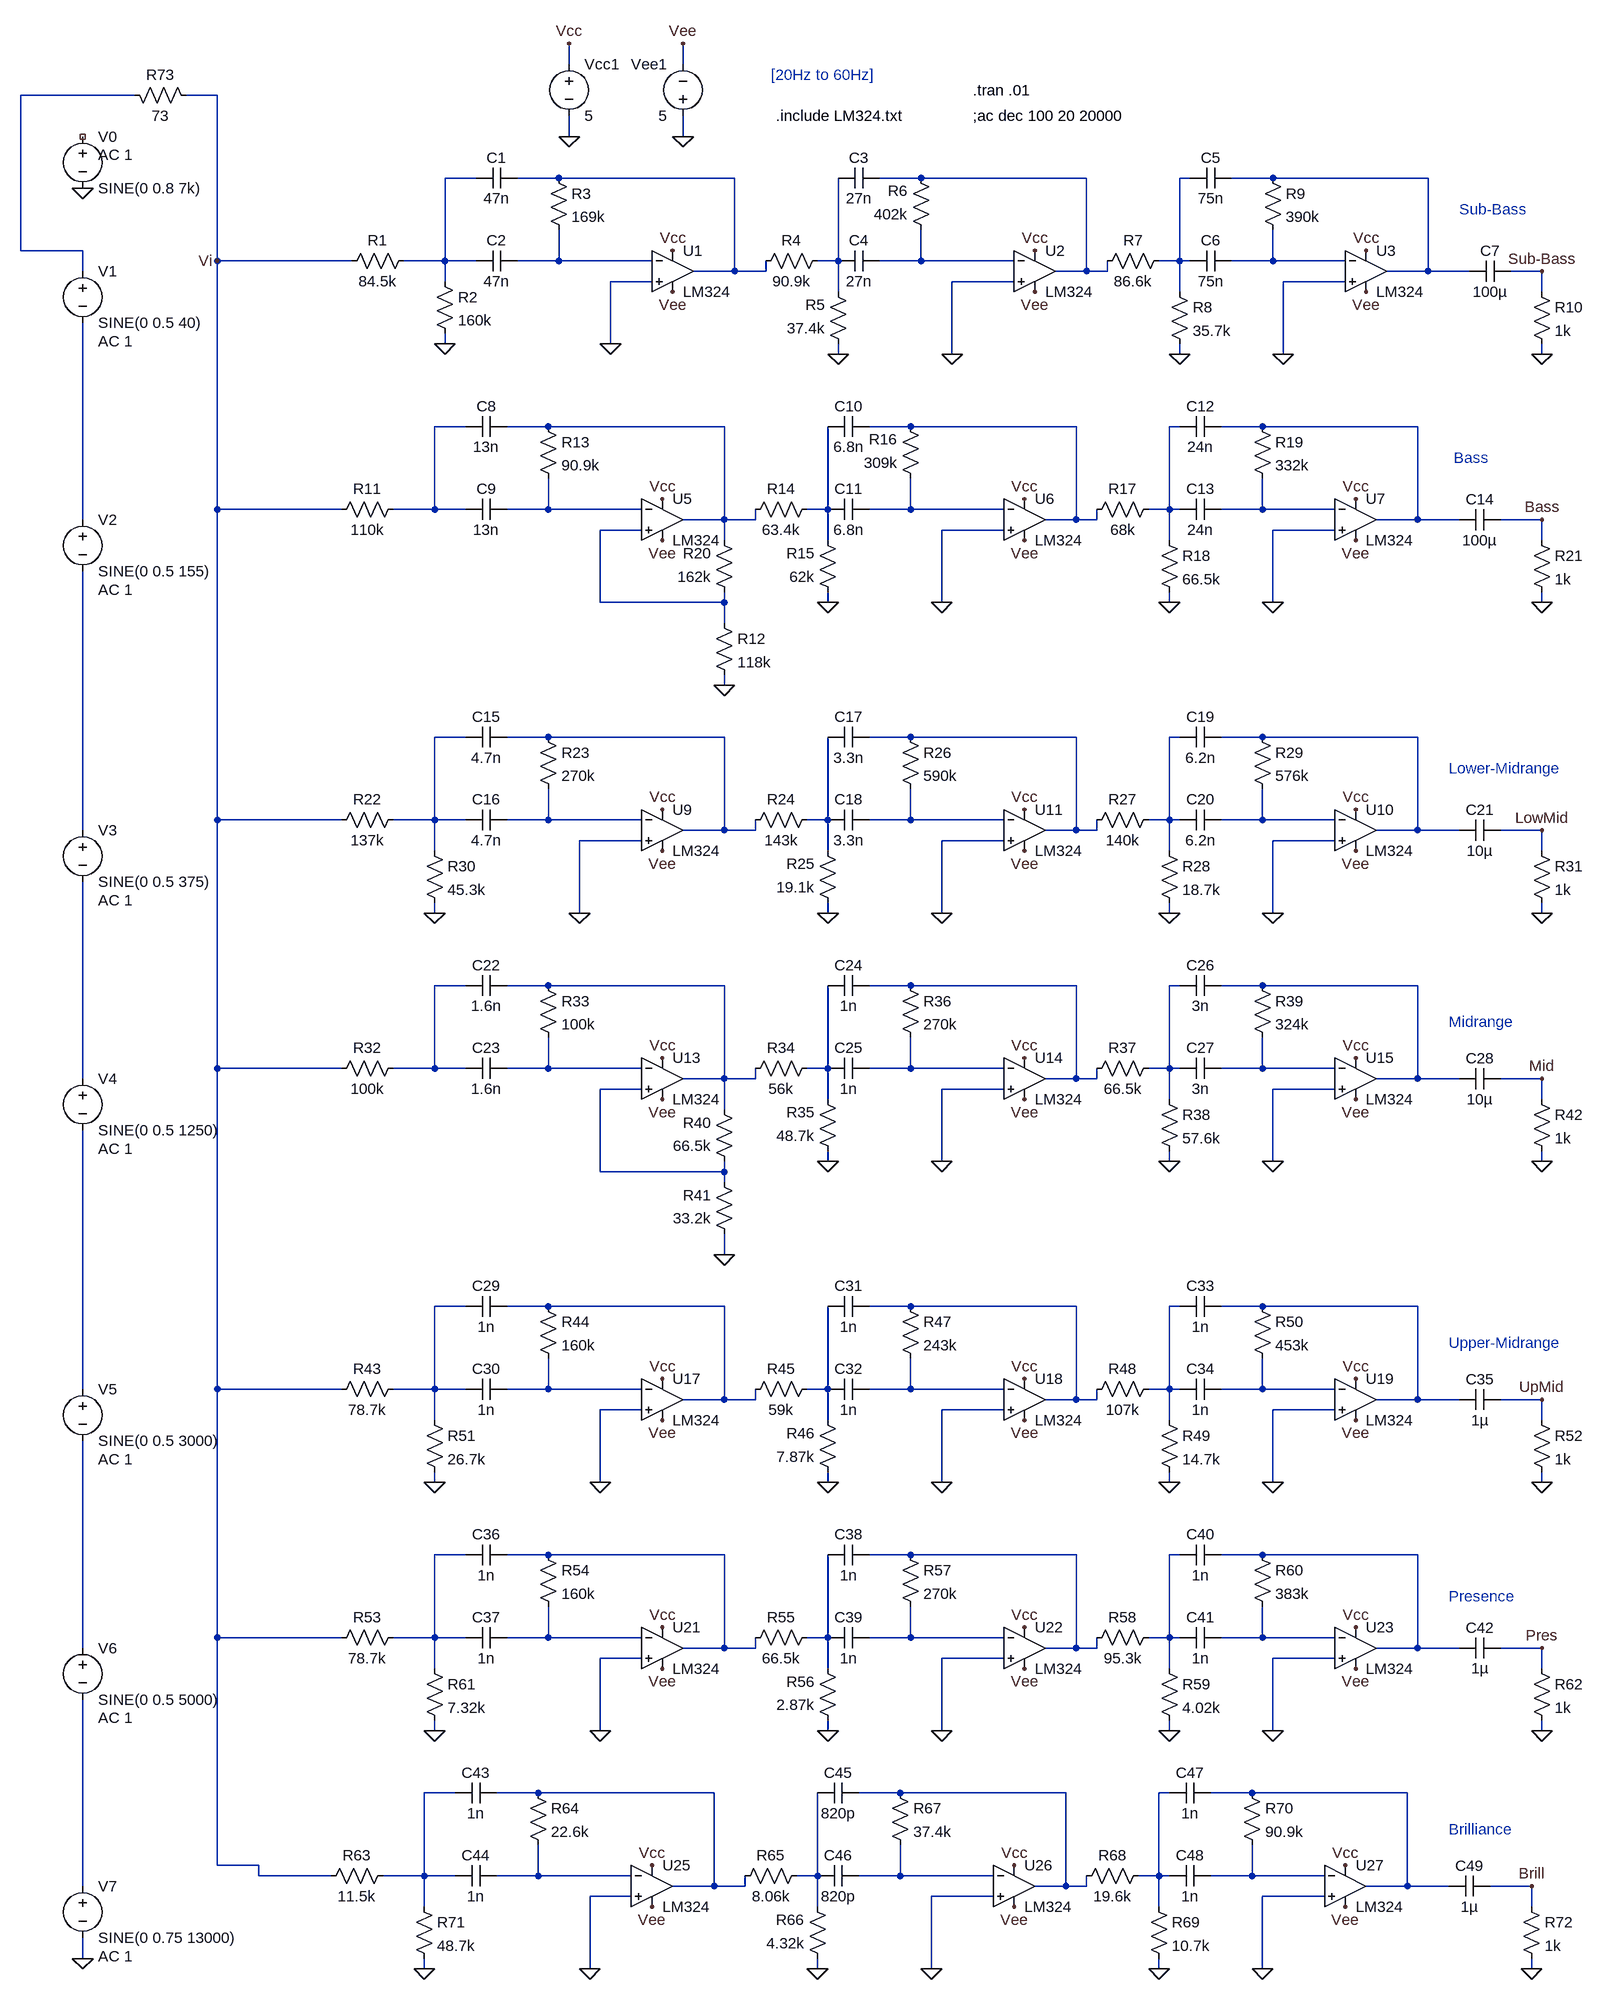
[diagram p0: schematic AllFilters.asc]
AllFilters.asc, the LTspice schematic file:
Version 4
SHEET 1 1368 1572
WIRE -208 -1392 -208 -1424
WIRE -32 -1392 -32 -1424
WIRE -880 -1344 -1056 -1344
WIRE -752 -1344 -800 -1344
WIRE -208 -1280 -208 -1312
WIRE -32 -1280 -32 -1312
WIRE -352 -1216 -400 -1216
WIRE -224 -1216 -288 -1216
WIRE 48 -1216 -224 -1216
WIRE 336 -1216 272 -1216
WIRE 592 -1216 336 -1216
WIRE 752 -1216 736 -1216
WIRE 880 -1216 816 -1216
WIRE 1120 -1216 880 -1216
WIRE -1056 -1104 -1056 -1344
WIRE -960 -1104 -1056 -1104
WIRE -752 -1088 -752 -1344
WIRE -544 -1088 -752 -1088
WIRE -400 -1088 -400 -1216
WIRE -400 -1088 -464 -1088
WIRE -352 -1088 -400 -1088
WIRE -224 -1088 -224 -1136
WIRE -224 -1088 -288 -1088
WIRE -80 -1088 -224 -1088
WIRE 208 -1088 208 -1216
WIRE 208 -1088 176 -1088
WIRE 336 -1088 336 -1136
WIRE 336 -1088 272 -1088
WIRE 480 -1088 336 -1088
WIRE 736 -1088 736 -1216
WIRE 736 -1088 704 -1088
WIRE 752 -1088 736 -1088
WIRE 880 -1088 880 -1136
WIRE 880 -1088 816 -1088
WIRE 992 -1088 880 -1088
WIRE -960 -1072 -960 -1104
WIRE 48 -1072 48 -1216
WIRE 48 -1072 -16 -1072
WIRE 96 -1072 96 -1088
WIRE 96 -1072 48 -1072
WIRE 592 -1072 592 -1216
WIRE 592 -1072 544 -1072
WIRE 624 -1072 624 -1088
WIRE 624 -1072 592 -1072
WIRE 1120 -1072 1120 -1216
WIRE 1120 -1072 1056 -1072
WIRE 1184 -1072 1120 -1072
WIRE 1296 -1072 1248 -1072
WIRE -400 -1056 -400 -1088
WIRE -80 -1056 -144 -1056
WIRE 480 -1056 384 -1056
WIRE 992 -1056 896 -1056
WIRE 208 -1040 208 -1088
WIRE 736 -1040 736 -1088
WIRE 1296 -1040 1296 -1072
WIRE -400 -960 -400 -976
WIRE -144 -960 -144 -1056
WIRE 208 -944 208 -960
WIRE 384 -944 384 -1056
WIRE 736 -944 736 -960
WIRE 896 -944 896 -1056
WIRE 1296 -944 1296 -960
WIRE -368 -832 -416 -832
WIRE -240 -832 -304 -832
WIRE 32 -832 -240 -832
WIRE 320 -832 256 -832
WIRE 576 -832 320 -832
WIRE 736 -832 720 -832
WIRE 864 -832 800 -832
WIRE 1104 -832 864 -832
WIRE -752 -704 -752 -1088
WIRE -560 -704 -752 -704
WIRE -416 -704 -416 -832
WIRE -416 -704 -480 -704
WIRE -368 -704 -416 -704
WIRE -240 -704 -240 -752
WIRE -240 -704 -304 -704
WIRE -96 -704 -240 -704
WIRE 192 -704 192 -832
WIRE 192 -704 160 -704
WIRE 320 -704 320 -752
WIRE 320 -704 256 -704
WIRE 464 -704 320 -704
WIRE 720 -704 720 -832
WIRE 720 -704 688 -704
WIRE 736 -704 720 -704
WIRE 864 -704 864 -752
WIRE 864 -704 800 -704
WIRE 976 -704 864 -704
WIRE -960 -688 -960 -992
WIRE 32 -688 32 -832
WIRE 32 -688 -32 -688
WIRE 80 -688 80 -704
WIRE 80 -688 32 -688
WIRE 576 -688 576 -832
WIRE 576 -688 528 -688
WIRE 608 -688 608 -704
WIRE 608 -688 576 -688
WIRE 1104 -688 1104 -832
WIRE 1104 -688 1040 -688
WIRE 1168 -688 1104 -688
WIRE 1296 -688 1232 -688
WIRE -96 -672 -160 -672
WIRE 464 -672 368 -672
WIRE 976 -672 880 -672
WIRE 32 -656 32 -688
WIRE 192 -656 192 -704
WIRE 720 -656 720 -704
WIRE 1296 -656 1296 -688
WIRE -160 -560 -160 -672
WIRE 32 -560 32 -576
WIRE 32 -560 -160 -560
WIRE 192 -560 192 -576
WIRE 368 -560 368 -672
WIRE 720 -560 720 -576
WIRE 880 -560 880 -672
WIRE 1296 -560 1296 -576
WIRE 32 -528 32 -560
WIRE 32 -432 32 -448
WIRE -368 -352 -416 -352
WIRE -240 -352 -304 -352
WIRE 32 -352 -240 -352
WIRE 320 -352 256 -352
WIRE 576 -352 320 -352
WIRE 736 -352 720 -352
WIRE 864 -352 800 -352
WIRE 1104 -352 864 -352
WIRE -752 -224 -752 -704
WIRE -560 -224 -752 -224
WIRE -416 -224 -416 -352
WIRE -416 -224 -480 -224
WIRE -368 -224 -416 -224
WIRE -240 -224 -240 -272
WIRE -240 -224 -304 -224
WIRE -96 -224 -240 -224
WIRE 192 -224 192 -352
WIRE 192 -224 160 -224
WIRE 320 -224 320 -272
WIRE 320 -224 256 -224
WIRE 464 -224 320 -224
WIRE 720 -224 720 -352
WIRE 720 -224 688 -224
WIRE 736 -224 720 -224
WIRE 864 -224 864 -272
WIRE 864 -224 800 -224
WIRE 976 -224 864 -224
WIRE -960 -208 -960 -608
WIRE 32 -208 32 -352
WIRE 32 -208 -32 -208
WIRE 80 -208 80 -224
WIRE 80 -208 32 -208
WIRE 576 -208 576 -352
WIRE 576 -208 528 -208
WIRE 608 -208 608 -224
WIRE 608 -208 576 -208
WIRE 1104 -208 1104 -352
WIRE 1104 -208 1040 -208
WIRE 1168 -208 1104 -208
WIRE 1296 -208 1232 -208
WIRE -96 -192 -192 -192
WIRE 464 -192 368 -192
WIRE 976 -192 880 -192
WIRE -416 -176 -416 -224
WIRE 192 -176 192 -224
WIRE 720 -176 720 -224
WIRE 1296 -176 1296 -208
WIRE -416 -80 -416 -96
WIRE -192 -80 -192 -192
WIRE 192 -80 192 -96
WIRE 368 -80 368 -192
WIRE 720 -80 720 -96
WIRE 880 -80 880 -192
WIRE 1296 -80 1296 -96
WIRE -368 32 -416 32
WIRE -240 32 -304 32
WIRE 32 32 -240 32
WIRE 320 32 256 32
WIRE 576 32 320 32
WIRE 736 32 720 32
WIRE 864 32 800 32
WIRE 1104 32 864 32
WIRE -752 160 -752 -224
WIRE -560 160 -752 160
WIRE -416 160 -416 32
WIRE -416 160 -480 160
WIRE -368 160 -416 160
WIRE -240 160 -240 112
WIRE -240 160 -304 160
WIRE -96 160 -240 160
WIRE 192 160 192 32
WIRE 192 160 160 160
WIRE 320 160 320 112
WIRE 320 160 256 160
WIRE 464 160 320 160
WIRE 720 160 720 32
WIRE 720 160 688 160
WIRE 736 160 720 160
WIRE 864 160 864 112
WIRE 864 160 800 160
WIRE 976 160 864 160
WIRE -960 176 -960 -128
WIRE 32 176 32 32
WIRE 32 176 -32 176
WIRE 80 176 80 160
WIRE 80 176 32 176
WIRE 576 176 576 32
WIRE 576 176 528 176
WIRE 608 176 608 160
WIRE 608 176 576 176
WIRE 1104 176 1104 32
WIRE 1104 176 1040 176
WIRE 1168 176 1104 176
WIRE 1296 176 1232 176
WIRE -96 192 -160 192
WIRE 464 192 368 192
WIRE 976 192 880 192
WIRE 192 208 192 160
WIRE 720 208 720 160
WIRE 1296 208 1296 176
WIRE 32 224 32 176
WIRE 192 304 192 288
WIRE 368 304 368 192
WIRE 720 304 720 288
WIRE 880 304 880 192
WIRE 1296 304 1296 288
WIRE -160 320 -160 192
WIRE 32 320 32 304
WIRE 32 320 -160 320
WIRE 32 336 32 320
WIRE 32 448 32 416
WIRE -368 528 -416 528
WIRE -240 528 -304 528
WIRE 32 528 -240 528
WIRE 320 528 256 528
WIRE 576 528 320 528
WIRE 736 528 720 528
WIRE 864 528 800 528
WIRE 1104 528 864 528
WIRE -960 656 -960 256
WIRE -752 656 -752 160
WIRE -560 656 -752 656
WIRE -416 656 -416 528
WIRE -416 656 -480 656
WIRE -368 656 -416 656
WIRE -240 656 -240 608
WIRE -240 656 -304 656
WIRE -96 656 -240 656
WIRE 192 656 192 528
WIRE 192 656 160 656
WIRE 320 656 320 608
WIRE 320 656 256 656
WIRE 464 656 320 656
WIRE 720 656 720 528
WIRE 720 656 688 656
WIRE 736 656 720 656
WIRE 864 656 864 608
WIRE 864 656 800 656
WIRE 976 656 864 656
WIRE 32 672 32 528
WIRE 32 672 -32 672
WIRE 80 672 80 656
WIRE 80 672 32 672
WIRE 576 672 576 528
WIRE 576 672 528 672
WIRE 608 672 608 656
WIRE 608 672 576 672
WIRE 1104 672 1104 528
WIRE 1104 672 1040 672
WIRE 1168 672 1104 672
WIRE 1296 672 1232 672
WIRE -96 688 -160 688
WIRE 464 688 368 688
WIRE 976 688 880 688
WIRE -416 704 -416 656
WIRE 192 704 192 656
WIRE 720 704 720 656
WIRE 1296 704 1296 672
WIRE -416 800 -416 784
WIRE -160 800 -160 688
WIRE 192 800 192 784
WIRE 368 800 368 688
WIRE 720 800 720 784
WIRE 880 800 880 688
WIRE 1296 800 1296 784
WIRE -368 912 -416 912
WIRE -240 912 -304 912
WIRE 32 912 -240 912
WIRE 320 912 256 912
WIRE 576 912 320 912
WIRE 736 912 720 912
WIRE 864 912 800 912
WIRE 1104 912 864 912
WIRE -752 1040 -752 656
WIRE -560 1040 -752 1040
WIRE -416 1040 -416 912
WIRE -416 1040 -480 1040
WIRE -368 1040 -416 1040
WIRE -240 1040 -240 992
WIRE -240 1040 -304 1040
WIRE -96 1040 -240 1040
WIRE 192 1040 192 912
WIRE 192 1040 160 1040
WIRE 320 1040 320 992
WIRE 320 1040 256 1040
WIRE 464 1040 320 1040
WIRE 720 1040 720 912
WIRE 720 1040 688 1040
WIRE 736 1040 720 1040
WIRE 864 1040 864 992
WIRE 864 1040 800 1040
WIRE 976 1040 864 1040
WIRE -960 1056 -960 736
WIRE 32 1056 32 912
WIRE 32 1056 -32 1056
WIRE 80 1056 80 1040
WIRE 80 1056 32 1056
WIRE 576 1056 576 912
WIRE 576 1056 528 1056
WIRE 608 1056 608 1040
WIRE 608 1056 576 1056
WIRE 1104 1056 1104 912
WIRE 1104 1056 1040 1056
WIRE 1168 1056 1104 1056
WIRE 1296 1056 1232 1056
WIRE -96 1072 -160 1072
WIRE 464 1072 368 1072
WIRE 976 1072 880 1072
WIRE -416 1088 -416 1040
WIRE 192 1088 192 1040
WIRE 720 1088 720 1040
WIRE 1296 1088 1296 1056
WIRE -416 1184 -416 1168
WIRE -160 1184 -160 1072
WIRE 192 1184 192 1168
WIRE 368 1184 368 1072
WIRE 720 1184 720 1168
WIRE 880 1184 880 1072
WIRE 1296 1184 1296 1168
WIRE -384 1280 -432 1280
WIRE -256 1280 -320 1280
WIRE 16 1280 -256 1280
WIRE 304 1280 240 1280
WIRE 560 1280 304 1280
WIRE 720 1280 704 1280
WIRE 848 1280 784 1280
WIRE 1088 1280 848 1280
WIRE -752 1392 -752 1040
WIRE -688 1392 -752 1392
WIRE -688 1408 -688 1392
WIRE -576 1408 -688 1408
WIRE -432 1408 -432 1280
WIRE -432 1408 -496 1408
WIRE -384 1408 -432 1408
WIRE -256 1408 -256 1360
WIRE -256 1408 -320 1408
WIRE -112 1408 -256 1408
WIRE 176 1408 176 1280
WIRE 176 1408 144 1408
WIRE 304 1408 304 1360
WIRE 304 1408 240 1408
WIRE 448 1408 304 1408
WIRE 704 1408 704 1280
WIRE 704 1408 672 1408
WIRE 720 1408 704 1408
WIRE 848 1408 848 1360
WIRE 848 1408 784 1408
WIRE 960 1408 848 1408
WIRE -960 1424 -960 1136
WIRE 16 1424 16 1280
WIRE 16 1424 -48 1424
WIRE 64 1424 64 1408
WIRE 64 1424 16 1424
WIRE 560 1424 560 1280
WIRE 560 1424 512 1424
WIRE 592 1424 592 1408
WIRE 592 1424 560 1424
WIRE 1088 1424 1088 1280
WIRE 1088 1424 1024 1424
WIRE 1152 1424 1088 1424
WIRE 1280 1424 1216 1424
WIRE -112 1440 -176 1440
WIRE 448 1440 352 1440
WIRE 960 1440 864 1440
WIRE -432 1456 -432 1408
WIRE 176 1456 176 1408
WIRE 704 1456 704 1408
WIRE 1280 1456 1280 1424
WIRE -960 1536 -960 1504
WIRE -432 1552 -432 1536
WIRE -176 1552 -176 1440
WIRE 176 1552 176 1536
WIRE 352 1552 352 1440
WIRE 704 1552 704 1536
WIRE 864 1552 864 1440
WIRE 1280 1552 1280 1536
FLAG 384 -944 0
FLAG -752 -1088 Vi
FLAG 896 -944 0
FLAG 736 -944 0
FLAG 208 -944 0
FLAG -400 -960 0
FLAG -144 -960 0
FLAG -48 -1040 Vee
FLAG -48 -1104 Vcc
FLAG 512 -1040 Vee
FLAG 512 -1104 Vcc
FLAG 1024 -1040 Vee
FLAG 1024 -1104 Vcc
FLAG -208 -1424 Vcc
FLAG -208 -1280 0
FLAG -32 -1280 0
FLAG -32 -1424 Vee
FLAG 1296 -944 0
FLAG 1296 -1072 Sub-Bass
FLAG 368 -560 0
FLAG 880 -560 0
FLAG 720 -560 0
FLAG 192 -560 0
FLAG 32 -432 0
FLAG -64 -656 Vee
FLAG -64 -720 Vcc
FLAG 496 -656 Vee
FLAG 496 -720 Vcc
FLAG 1008 -656 Vee
FLAG 1008 -720 Vcc
FLAG 1296 -560 0
FLAG 1296 -688 Bass
FLAG 368 -80 0
FLAG 880 -80 0
FLAG 720 -80 0
FLAG 192 -80 0
FLAG -192 -80 0
FLAG -416 -80 0
FLAG -64 -176 Vee
FLAG -64 -240 Vcc
FLAG 1008 -176 Vee
FLAG 1008 -240 Vcc
FLAG 496 -176 Vee
FLAG 496 -240 Vcc
FLAG 1296 -80 0
FLAG 1296 -208 LowMid
FLAG 368 304 0
FLAG 880 304 0
FLAG 720 304 0
FLAG 192 304 0
FLAG 32 448 0
FLAG -64 208 Vee
FLAG -64 144 Vcc
FLAG 496 208 Vee
FLAG 496 144 Vcc
FLAG 1008 208 Vee
FLAG 1008 144 Vcc
FLAG 1296 304 0
FLAG 1296 176 Mid
FLAG 368 800 0
FLAG 880 800 0
FLAG 720 800 0
FLAG 192 800 0
FLAG -416 800 0
FLAG -160 800 0
FLAG -64 704 Vee
FLAG -64 640 Vcc
FLAG 496 704 Vee
FLAG 496 640 Vcc
FLAG 1008 704 Vee
FLAG 1008 640 Vcc
FLAG 1296 800 0
FLAG 1296 672 UpMid
FLAG 368 1184 0
FLAG 880 1184 0
FLAG 720 1184 0
FLAG 192 1184 0
FLAG -416 1184 0
FLAG -160 1184 0
FLAG -64 1088 Vee
FLAG -64 1024 Vcc
FLAG 496 1088 Vee
FLAG 496 1024 Vcc
FLAG 1008 1088 Vee
FLAG 1008 1024 Vcc
FLAG 1296 1184 0
FLAG 1296 1056 Pres
FLAG 352 1552 0
FLAG -960 1536 0
FLAG 864 1552 0
FLAG 704 1552 0
FLAG 176 1552 0
FLAG -432 1552 0
FLAG -176 1552 0
FLAG -80 1456 Vee
FLAG -80 1392 Vcc
FLAG 480 1456 Vee
FLAG 480 1392 Vcc
FLAG 992 1456 Vee
FLAG 992 1392 Vcc
FLAG 1280 1552 0
FLAG 1280 1424 Brill
FLAG -960 -1200 0
SYMBOL res -448 -1104 R90
WINDOW 0 0 56 VBottom 2
WINDOW 3 32 56 VTop 2
SYMATTR InstName R1
SYMATTR Value 84.5k
SYMBOL voltage -960 -1088 R0
WINDOW 123 24 124 Left 2
WINDOW 39 0 0 Left 0
SYMATTR Value2 AC 1
SYMATTR InstName V1
SYMATTR Value SINE(0 0.5 40)
SYMBOL res -416 -1072 R0
SYMATTR InstName R2
SYMATTR Value 160k
SYMBOL res -240 -1232 R0
SYMATTR InstName R3
SYMATTR Value 169k
SYMBOL res 192 -1104 R90
WINDOW 0 0 56 VBottom 2
WINDOW 3 32 56 VTop 2
SYMATTR InstName R4
SYMATTR Value 90.9k
SYMBOL res 224 -944 R180
WINDOW 0 36 76 Left 2
WINDOW 3 36 40 Left 2
SYMATTR InstName R5
SYMATTR Value 37.4k
SYMBOL res 352 -1120 R180
WINDOW 0 36 76 Left 2
WINDOW 3 36 40 Left 2
SYMATTR InstName R6
SYMATTR Value 402k
SYMBOL res 608 -1072 R270
WINDOW 0 32 56 VTop 2
WINDOW 3 0 56 VBottom 2
SYMATTR InstName R7
SYMATTR Value 86.6k
SYMBOL res 720 -1056 R0
SYMATTR InstName R8
SYMATTR Value 35.7k
SYMBOL res 864 -1232 R0
SYMATTR InstName R9
SYMATTR Value 390k
SYMBOL cap -288 -1232 R90
WINDOW 0 0 32 VBottom 2
WINDOW 3 32 32 VTop 2
SYMATTR InstName C1
SYMATTR Value 47n
SYMBOL cap -288 -1104 R90
WINDOW 0 0 32 VBottom 2
WINDOW 3 32 32 VTop 2
SYMATTR InstName C2
SYMATTR Value 47n
SYMBOL cap 272 -1232 R90
WINDOW 0 0 32 VBottom 2
WINDOW 3 32 32 VTop 2
SYMATTR InstName C3
SYMATTR Value 27n
SYMBOL cap 272 -1104 R90
WINDOW 0 0 32 VBottom 2
WINDOW 3 32 32 VTop 2
SYMATTR InstName C4
SYMATTR Value 27n
SYMBOL cap 816 -1232 R90
WINDOW 0 0 32 VBottom 2
WINDOW 3 32 32 VTop 2
SYMATTR InstName C5
SYMATTR Value 75n
SYMBOL cap 816 -1104 R90
WINDOW 0 0 32 VBottom 2
WINDOW 3 32 32 VTop 2
SYMATTR InstName C6
SYMATTR Value 75n
SYMBOL OpAmps\\opamp2 -48 -1136 R0
SYMATTR InstName U1
SYMATTR Value LM324
SYMBOL OpAmps\\opamp2 512 -1136 R0
SYMATTR InstName U2
SYMATTR Value LM324
SYMBOL OpAmps\\opamp2 1024 -1136 R0
SYMATTR InstName U3
SYMATTR Value LM324
SYMBOL voltage -208 -1408 R0
WINDOW 123 0 0 Left 0
WINDOW 39 0 0 Left 0
SYMATTR InstName Vcc1
SYMATTR Value 5
SYMBOL voltage -32 -1296 R180
WINDOW 0 24 96 Left 2
WINDOW 3 24 16 Left 2
WINDOW 123 0 0 Left 0
WINDOW 39 0 0 Left 0
SYMATTR InstName Vee1
SYMATTR Value 5
SYMBOL cap 1248 -1088 R90
WINDOW 0 0 32 VBottom 2
WINDOW 3 32 32 VTop 2
SYMATTR InstName C7
SYMATTR Value 100µ
SYMBOL res 1280 -1056 R0
SYMATTR InstName R10
SYMATTR Value 1k
SYMBOL res -464 -720 R90
WINDOW 0 0 56 VBottom 2
WINDOW 3 32 56 VTop 2
SYMATTR InstName R11
SYMATTR Value 110k
SYMBOL voltage -960 -704 R0
WINDOW 123 24 124 Left 2
WINDOW 39 0 0 Left 0
SYMATTR Value2 AC 1
SYMATTR InstName V2
SYMATTR Value SINE(0 0.5 155)
SYMBOL res 16 -544 R0
SYMATTR InstName R12
SYMATTR Value 118k
SYMBOL res -256 -848 R0
SYMATTR InstName R13
SYMATTR Value 90.9k
SYMBOL res 176 -720 R90
WINDOW 0 0 56 VBottom 2
WINDOW 3 32 56 VTop 2
SYMATTR InstName R14
SYMATTR Value 63.4k
SYMBOL res 208 -560 R180
WINDOW 0 36 76 Left 2
WINDOW 3 36 40 Left 2
SYMATTR InstName R15
SYMATTR Value 62k
SYMBOL res 336 -736 R180
WINDOW 0 36 76 Left 2
WINDOW 3 36 40 Left 2
SYMATTR InstName R16
SYMATTR Value 309k
SYMBOL res 592 -688 R270
WINDOW 0 32 56 VTop 2
WINDOW 3 0 56 VBottom 2
SYMATTR InstName R17
SYMATTR Value 68k
SYMBOL res 704 -672 R0
SYMATTR InstName R18
SYMATTR Value 66.5k
SYMBOL res 848 -848 R0
SYMATTR InstName R19
SYMATTR Value 332k
SYMBOL cap -304 -848 R90
WINDOW 0 0 32 VBottom 2
WINDOW 3 32 32 VTop 2
SYMATTR InstName C8
SYMATTR Value 13n
SYMBOL cap -304 -720 R90
WINDOW 0 0 32 VBottom 2
WINDOW 3 32 32 VTop 2
SYMATTR InstName C9
SYMATTR Value 13n
SYMBOL cap 256 -848 R90
WINDOW 0 0 32 VBottom 2
WINDOW 3 32 32 VTop 2
SYMATTR InstName C10
SYMATTR Value 6.8n
SYMBOL cap 256 -720 R90
WINDOW 0 0 32 VBottom 2
WINDOW 3 32 32 VTop 2
SYMATTR InstName C11
SYMATTR Value 6.8n
SYMBOL cap 800 -848 R90
WINDOW 0 0 32 VBottom 2
WINDOW 3 32 32 VTop 2
SYMATTR InstName C12
SYMATTR Value 24n
SYMBOL cap 800 -720 R90
WINDOW 0 0 32 VBottom 2
WINDOW 3 32 32 VTop 2
SYMATTR InstName C13
SYMATTR Value 24n
SYMBOL res 48 -560 R180
WINDOW 0 36 76 Left 2
WINDOW 3 36 40 Left 2
SYMATTR InstName R20
SYMATTR Value 162k
SYMBOL OpAmps\\opamp2 -64 -752 R0
SYMATTR InstName U5
SYMATTR Value LM324
SYMBOL OpAmps\\opamp2 496 -752 R0
SYMATTR InstName U6
SYMATTR Value LM324
SYMBOL OpAmps\\opamp2 1008 -752 R0
SYMATTR InstName U7
SYMATTR Value LM324
SYMBOL cap 1232 -704 R90
WINDOW 0 0 32 VBottom 2
WINDOW 3 32 32 VTop 2
SYMATTR InstName C14
SYMATTR Value 100µ
SYMBOL res 1280 -672 R0
SYMATTR InstName R21
SYMATTR Value 1k
SYMBOL res -464 -240 R90
WINDOW 0 0 56 VBottom 2
WINDOW 3 32 56 VTop 2
SYMATTR InstName R22
SYMATTR Value 137k
SYMBOL voltage -960 -224 R0
WINDOW 123 24 124 Left 2
WINDOW 39 0 0 Left 0
SYMATTR Value2 AC 1
SYMATTR InstName V3
SYMATTR Value SINE(0 0.5 375)
SYMBOL res -256 -368 R0
SYMATTR InstName R23
SYMATTR Value 270k
SYMBOL res 176 -240 R90
WINDOW 0 0 56 VBottom 2
WINDOW 3 32 56 VTop 2
SYMATTR InstName R24
SYMATTR Value 143k
SYMBOL res 208 -80 R180
WINDOW 0 36 76 Left 2
WINDOW 3 36 40 Left 2
SYMATTR InstName R25
SYMATTR Value 19.1k
SYMBOL res 304 -368 R0
SYMATTR InstName R26
SYMATTR Value 590k
SYMBOL res 592 -208 R270
WINDOW 0 32 56 VTop 2
WINDOW 3 0 56 VBottom 2
SYMATTR InstName R27
SYMATTR Value 140k
SYMBOL res 704 -192 R0
SYMATTR InstName R28
SYMATTR Value 18.7k
SYMBOL res 848 -368 R0
SYMATTR InstName R29
SYMATTR Value 576k
SYMBOL cap -304 -368 R90
WINDOW 0 0 32 VBottom 2
WINDOW 3 32 32 VTop 2
SYMATTR InstName C15
SYMATTR Value 4.7n
SYMBOL cap -304 -240 R90
WINDOW 0 0 32 VBottom 2
WINDOW 3 32 32 VTop 2
SYMATTR InstName C16
SYMATTR Value 4.7n
SYMBOL cap 256 -368 R90
WINDOW 0 0 32 VBottom 2
WINDOW 3 32 32 VTop 2
SYMATTR InstName C17
SYMATTR Value 3.3n
SYMBOL cap 256 -240 R90
WINDOW 0 0 32 VBottom 2
WINDOW 3 32 32 VTop 2
SYMATTR InstName C18
SYMATTR Value 3.3n
SYMBOL cap 800 -368 R90
WINDOW 0 0 32 VBottom 2
WINDOW 3 32 32 VTop 2
SYMATTR InstName C19
SYMATTR Value 6.2n
SYMBOL cap 800 -240 R90
WINDOW 0 0 32 VBottom 2
WINDOW 3 32 32 VTop 2
SYMATTR InstName C20
SYMATTR Value 6.2n
SYMBOL res -432 -192 R0
SYMATTR InstName R30
SYMATTR Value 45.3k
SYMBOL OpAmps\\opamp2 -64 -272 R0
SYMATTR InstName U9
SYMATTR Value LM324
SYMBOL OpAmps\\opamp2 1008 -272 R0
SYMATTR InstName U10
SYMATTR Value LM324
SYMBOL OpAmps\\opamp2 496 -272 R0
SYMATTR InstName U11
SYMATTR Value LM324
SYMBOL cap 1232 -224 R90
WINDOW 0 0 32 VBottom 2
WINDOW 3 32 32 VTop 2
SYMATTR InstName C21
SYMATTR Value 10µ
SYMBOL res 1280 -192 R0
SYMATTR InstName R31
SYMATTR Value 1k
SYMBOL res -464 144 R90
WINDOW 0 0 56 VBottom 2
WINDOW 3 32 56 VTop 2
SYMATTR InstName R32
SYMATTR Value 100k
SYMBOL voltage -960 160 R0
WINDOW 123 24 124 Left 2
WINDOW 39 0 0 Left 0
SYMATTR Value2 AC 1
SYMATTR InstName V4
SYMATTR Value SINE(0 0.5 1250)
SYMBOL res -256 16 R0
SYMATTR InstName R33
SYMATTR Value 100k
SYMBOL res 176 144 R90
WINDOW 0 0 56 VBottom 2
WINDOW 3 32 56 VTop 2
SYMATTR InstName R34
SYMATTR Value 56k
SYMBOL res 208 304 R180
WINDOW 0 36 76 Left 2
WINDOW 3 36 40 Left 2
SYMATTR InstName R35
SYMATTR Value 48.7k
SYMBOL res 304 16 R0
SYMATTR InstName R36
SYMATTR Value 270k
SYMBOL res 592 176 R270
WINDOW 0 32 56 VTop 2
WINDOW 3 0 56 VBottom 2
SYMATTR InstName R37
SYMATTR Value 66.5k
SYMBOL res 704 192 R0
SYMATTR InstName R38
SYMATTR Value 57.6k
SYMBOL res 848 16 R0
SYMATTR InstName R39
SYMATTR Value 324k
SYMBOL cap -304 16 R90
WINDOW 0 0 32 VBottom 2
WINDOW 3 32 32 VTop 2
SYMATTR InstName C22
SYMATTR Value 1.6n
SYMBOL cap -304 144 R90
WINDOW 0 0 32 VBottom 2
WINDOW 3 32 32 VTop 2
SYMATTR InstName C23
SYMATTR Value 1.6n
SYMBOL cap 256 16 R90
WINDOW 0 0 32 VBottom 2
WINDOW 3 32 32 VTop 2
SYMATTR InstName C24
SYMATTR Value 1n
SYMBOL cap 256 144 R90
WINDOW 0 0 32 VBottom 2
WINDOW 3 32 32 VTop 2
SYMATTR InstName C25
SYMATTR Value 1n
SYMBOL cap 800 16 R90
WINDOW 0 0 32 VBottom 2
WINDOW 3 32 32 VTop 2
SYMATTR InstName C26
SYMATTR Value 3n
SYMBOL cap 800 144 R90
WINDOW 0 0 32 VBottom 2
WINDOW 3 32 32 VTop 2
SYMATTR InstName C27
SYMATTR Value 3n
SYMBOL res 48 320 R180
WINDOW 0 36 76 Left 2
WINDOW 3 36 40 Left 2
SYMATTR InstName R40
SYMATTR Value 66.5k
SYMBOL res 48 432 R180
WINDOW 0 36 76 Left 2
WINDOW 3 36 40 Left 2
SYMATTR InstName R41
SYMATTR Value 33.2k
SYMBOL OpAmps\\opamp2 -64 112 R0
SYMATTR InstName U13
SYMATTR Value LM324
SYMBOL OpAmps\\opamp2 496 112 R0
SYMATTR InstName U14
SYMATTR Value LM324
SYMBOL OpAmps\\opamp2 1008 112 R0
SYMATTR InstName U15
SYMATTR Value LM324
SYMBOL cap 1232 160 R90
WINDOW 0 0 32 VBottom 2
WINDOW 3 32 32 VTop 2
SYMATTR InstName C28
SYMATTR Value 10µ
SYMBOL res 1280 192 R0
SYMATTR InstName R42
SYMATTR Value 1k
SYMBOL res -464 640 R90
WINDOW 0 0 56 VBottom 2
WINDOW 3 32 56 VTop 2
SYMATTR InstName R43
SYMATTR Value 78.7k
SYMBOL voltage -960 640 R0
WINDOW 123 24 124 Left 2
WINDOW 39 0 0 Left 0
SYMATTR Value2 AC 1
SYMATTR InstName V5
SYMATTR Value SINE(0 0.5 3000)
SYMBOL res -256 512 R0
SYMATTR InstName R44
SYMATTR Value 160k
SYMBOL res 176 640 R90
WINDOW 0 0 56 VBottom 2
WINDOW 3 32 56 VTop 2
SYMATTR InstName R45
SYMATTR Value 59k
SYMBOL res 208 800 R180
WINDOW 0 36 76 Left 2
WINDOW 3 36 40 Left 2
SYMATTR InstName R46
SYMATTR Value 7.87k
SYMBOL res 304 512 R0
SYMATTR InstName R47
SYMATTR Value 243k
SYMBOL res 592 672 R270
WINDOW 0 32 56 VTop 2
WINDOW 3 0 56 VBottom 2
SYMATTR InstName R48
SYMATTR Value 107k
SYMBOL res 704 688 R0
SYMATTR InstName R49
SYMATTR Value 14.7k
SYMBOL res 848 512 R0
SYMATTR InstName R50
SYMATTR Value 453k
SYMBOL cap -304 512 R90
WINDOW 0 0 32 VBottom 2
WINDOW 3 32 32 VTop 2
SYMATTR InstName C29
SYMATTR Value 1n
SYMBOL cap -304 640 R90
WINDOW 0 0 32 VBottom 2
WINDOW 3 32 32 VTop 2
SYMATTR InstName C30
SYMATTR Value 1n
SYMBOL cap 256 512 R90
WINDOW 0 0 32 VBottom 2
WINDOW 3 32 32 VTop 2
SYMATTR InstName C31
SYMATTR Value 1n
SYMBOL cap 256 640 R90
WINDOW 0 0 32 VBottom 2
WINDOW 3 32 32 VTop 2
SYMATTR InstName C32
SYMATTR Value 1n
SYMBOL cap 800 512 R90
WINDOW 0 0 32 VBottom 2
WINDOW 3 32 32 VTop 2
SYMATTR InstName C33
SYMATTR Value 1n
SYMBOL cap 800 640 R90
WINDOW 0 0 32 VBottom 2
WINDOW 3 32 32 VTop 2
SYMATTR InstName C34
SYMATTR Value 1n
SYMBOL res -432 688 R0
SYMATTR InstName R51
SYMATTR Value 26.7k
SYMBOL OpAmps\\opamp2 -64 608 R0
SYMATTR InstName U17
SYMATTR Value LM324
SYMBOL OpAmps\\opamp2 496 608 R0
SYMATTR InstName U18
SYMATTR Value LM324
SYMBOL OpAmps\\opamp2 1008 608 R0
SYMATTR InstName U19
SYMATTR Value LM324
SYMBOL cap 1232 656 R90
WINDOW 0 0 32 VBottom 2
WINDOW 3 32 32 VTop 2
SYMATTR InstName C35
SYMATTR Value 1µ
SYMBOL res 1280 688 R0
SYMATTR InstName R52
SYMATTR Value 1k
SYMBOL res -464 1024 R90
WINDOW 0 0 56 VBottom 2
WINDOW 3 32 56 VTop 2
SYMATTR InstName R53
SYMATTR Value 78.7k
SYMBOL voltage -960 1040 R0
WINDOW 123 24 124 Left 2
WINDOW 39 0 0 Left 0
SYMATTR Value2 AC 1
SYMATTR InstName V6
SYMATTR Value SINE(0 0.5 5000)
SYMBOL res -256 896 R0
SYMATTR InstName R54
SYMATTR Value 160k
SYMBOL res 176 1024 R90
WINDOW 0 0 56 VBottom 2
WINDOW 3 32 56 VTop 2
SYMATTR InstName R55
SYMATTR Value 66.5k
SYMBOL res 208 1184 R180
WINDOW 0 36 76 Left 2
WINDOW 3 36 40 Left 2
SYMATTR InstName R56
SYMATTR Value 2.87k
SYMBOL res 304 896 R0
SYMATTR InstName R57
SYMATTR Value 270k
SYMBOL res 592 1056 R270
WINDOW 0 32 56 VTop 2
WINDOW 3 0 56 VBottom 2
SYMATTR InstName R58
SYMATTR Value 95.3k
SYMBOL res 704 1072 R0
SYMATTR InstName R59
SYMATTR Value 4.02k
SYMBOL res 848 896 R0
SYMATTR InstName R60
SYMATTR Value 383k
SYMBOL cap -304 896 R90
WINDOW 0 0 32 VBottom 2
WINDOW 3 32 32 VTop 2
SYMATTR InstName C36
SYMATTR Value 1n
SYMBOL cap -304 1024 R90
WINDOW 0 0 32 VBottom 2
WINDOW 3 32 32 VTop 2
SYMATTR InstName C37
SYMATTR Value 1n
SYMBOL cap 256 896 R90
WINDOW 0 0 32 VBottom 2
WINDOW 3 32 32 VTop 2
SYMATTR InstName C38
SYMATTR Value 1n
SYMBOL cap 256 1024 R90
WINDOW 0 0 32 VBottom 2
WINDOW 3 32 32 VTop 2
SYMATTR InstName C39
SYMATTR Value 1n
SYMBOL cap 800 896 R90
WINDOW 0 0 32 VBottom 2
WINDOW 3 32 32 VTop 2
SYMATTR InstName C40
SYMATTR Value 1n
SYMBOL cap 800 1024 R90
WINDOW 0 0 32 VBottom 2
WINDOW 3 32 32 VTop 2
SYMATTR InstName C41
SYMATTR Value 1n
SYMBOL res -432 1072 R0
SYMATTR InstName R61
SYMATTR Value 7.32k
SYMBOL OpAmps\\opamp2 -64 992 R0
SYMATTR InstName U21
SYMATTR Value LM324
SYMBOL OpAmps\\opamp2 496 992 R0
SYMATTR InstName U22
SYMATTR Value LM324
SYMBOL OpAmps\\opamp2 1008 992 R0
SYMATTR InstName U23
SYMATTR Value LM324
SYMBOL cap 1232 1040 R90
WINDOW 0 0 32 VBottom 2
WINDOW 3 32 32 VTop 2
SYMATTR InstName C42
SYMATTR Value 1µ
SYMBOL res 1280 1072 R0
SYMATTR InstName R62
SYMATTR Value 1k
SYMBOL res -480 1392 R90
WINDOW 0 0 56 VBottom 2
WINDOW 3 32 56 VTop 2
SYMATTR InstName R63
SYMATTR Value 11.5k
SYMBOL voltage -960 1408 R0
WINDOW 123 24 124 Left 2
WINDOW 39 0 0 Left 0
SYMATTR Value2 AC 1
SYMATTR InstName V7
SYMATTR Value SINE(0 0.75 13000)
SYMBOL res -272 1264 R0
SYMATTR InstName R64
SYMATTR Value 22.6k
SYMBOL res 160 1392 R90
WINDOW 0 0 56 VBottom 2
WINDOW 3 32 56 VTop 2
SYMATTR InstName R65
SYMATTR Value 8.06k
SYMBOL res 192 1552 R180
WINDOW 0 36 76 Left 2
WINDOW 3 36 40 Left 2
SYMATTR InstName R66
SYMATTR Value 4.32k
SYMBOL res 288 1264 R0
SYMATTR InstName R67
SYMATTR Value 37.4k
SYMBOL res 576 1424 R270
WINDOW 0 32 56 VTop 2
WINDOW 3 0 56 VBottom 2
SYMATTR InstName R68
SYMATTR Value 19.6k
SYMBOL res 688 1440 R0
SYMATTR InstName R69
SYMATTR Value 10.7k
SYMBOL res 832 1264 R0
SYMATTR InstName R70
SYMATTR Value 90.9k
SYMBOL cap -320 1264 R90
WINDOW 0 0 32 VBottom 2
WINDOW 3 32 32 VTop 2
SYMATTR InstName C43
SYMATTR Value 1n
SYMBOL cap -320 1392 R90
WINDOW 0 0 32 VBottom 2
WINDOW 3 32 32 VTop 2
SYMATTR InstName C44
SYMATTR Value 1n
SYMBOL cap 240 1264 R90
WINDOW 0 0 32 VBottom 2
WINDOW 3 32 32 VTop 2
SYMATTR InstName C45
SYMATTR Value 820p
SYMBOL cap 240 1392 R90
WINDOW 0 0 32 VBottom 2
WINDOW 3 32 32 VTop 2
SYMATTR InstName C46
SYMATTR Value 820p
SYMBOL cap 784 1264 R90
WINDOW 0 0 32 VBottom 2
WINDOW 3 32 32 VTop 2
SYMATTR InstName C47
SYMATTR Value 1n
SYMBOL cap 784 1392 R90
WINDOW 0 0 32 VBottom 2
WINDOW 3 32 32 VTop 2
SYMATTR InstName C48
SYMATTR Value 1n
SYMBOL res -448 1440 R0
SYMATTR InstName R71
SYMATTR Value 48.7k
SYMBOL OpAmps\\opamp2 -80 1360 R0
SYMATTR InstName U25
SYMATTR Value LM324
SYMBOL OpAmps\\opamp2 480 1360 R0
SYMATTR InstName U26
SYMATTR Value LM324
SYMBOL OpAmps\\opamp2 992 1360 R0
SYMATTR InstName U27
SYMATTR Value LM324
SYMBOL cap 1216 1408 R90
WINDOW 0 0 32 VBottom 2
WINDOW 3 32 32 VTop 2
SYMATTR InstName C49
SYMATTR Value 1µ
SYMBOL res 1264 1440 R0
SYMATTR InstName R72
SYMATTR Value 1k
SYMBOL voltage -960 -1296 R0
WINDOW 123 24 44 Left 2
WINDOW 39 0 0 Left 0
SYMATTR Value2 AC 1
SYMATTR InstName V0
SYMATTR Value SINE(0 0.8 7k)
SYMBOL res -896 -1360 M90
WINDOW 0 0 56 VBottom 2
WINDOW 3 32 56 VTop 2
SYMATTR InstName R73
SYMATTR Value 73
TEXT 416 -1352 Left 2 !.tran .01
TEXT 416 -1312 Left 2 !;ac dec 100 20 20000
TEXT 104 -1376 Left 2 ;[20Hz to 60Hz]
TEXT 112 -1312 Left 2 !.include LM324.txt
TEXT 1168 -1168 Left 2 ;Sub-Bass
TEXT 1160 -784 Left 2 ;Bass
TEXT 1152 -304 Left 2 ;Lower-Midrange
TEXT 1152 88 Left 2 ;Midrange
TEXT 1152 584 Left 2 ;Upper-Midrange
TEXT 1152 976 Left 2 ;Presence
TEXT 1152 1336 Left 2 ;Brilliance

The netlist it stands for:
* AllFilters.asc
R1 N002 Vi 84.5k
V1 N001 N020 SINE(0 0.5 40) AC 1
R2 N002 0 160k
R3 N003 N007 169k
R4 N008 N003 90.9k
R5 0 N008 37.4k
R6 N009 N004 402k
R7 N004 N005 86.6k
R8 N005 0 35.7k
R9 N006 N010 390k
C1 N003 N002 47n
C2 N007 N002 47n
C3 N004 N008 27n
C4 N009 N008 27n
C5 N006 N005 75n
C6 N010 N005 75n
XU1 0 N007 Vcc Vee N003 LM324  ; pins In+ In- V+ V- OUT
XU2 0 N009 Vcc Vee N004 LM324  ; pins In+ In- V+ V- OUT
XU3 0 N010 Vcc Vee N006 LM324  ; pins In+ In- V+ V- OUT
Vcc1 Vcc 0 5
Vee1 0 Vee 5
C7 Sub-Bass N006 100µ
R10 Sub-Bass 0 1k
R11 N011 Vi 110k
V2 N020 N031 SINE(0 0.5 155) AC 1
R12 N021 0 118k
R13 N012 N016 90.9k
R14 N017 N012 63.4k
R15 0 N017 62k
R16 N018 N013 309k
R17 N013 N014 68k
R18 N014 0 66.5k
R19 N015 N019 332k
C8 N012 N011 13n
C9 N016 N011 13n
C10 N013 N017 6.8n
C11 N018 N017 6.8n
C12 N015 N014 24n
C13 N019 N014 24n
R20 N021 N012 162k
XU5 N021 N016 Vcc Vee N012 LM324  ; pins In+ In- V+ V- OUT
XU6 0 N018 Vcc Vee N013 LM324  ; pins In+ In- V+ V- OUT
XU7 0 N019 Vcc Vee N015 LM324  ; pins In+ In- V+ V- OUT
C14 Bass N015 100µ
R21 Bass 0 1k
R22 N022 Vi 137k
V3 N031 N041 SINE(0 0.5 375) AC 1
R23 N023 N027 270k
R24 N028 N023 143k
R25 0 N028 19.1k
R26 N024 N029 590k
R27 N024 N025 140k
R28 N025 0 18.7k
R29 N026 N030 576k
C15 N023 N022 4.7n
C16 N027 N022 4.7n
C17 N024 N028 3.3n
C18 N029 N028 3.3n
C19 N026 N025 6.2n
C20 N030 N025 6.2n
R30 N022 0 45.3k
XU9 0 N027 Vcc Vee N023 LM324  ; pins In+ In- V+ V- OUT
XU10 0 N030 Vcc Vee N026 LM324  ; pins In+ In- V+ V- OUT
XU11 0 N029 Vcc Vee N024 LM324  ; pins In+ In- V+ V- OUT
C21 LowMid N026 10µ
R31 LowMid 0 1k
R32 N032 Vi 100k
V4 N041 N048 SINE(0 0.5 1250) AC 1
R33 N033 N037 100k
R34 N038 N033 56k
R35 0 N038 48.7k
R36 N034 N039 270k
R37 N034 N035 66.5k
R38 N035 0 57.6k
R39 N036 N040 324k
C22 N033 N032 1.6n
C23 N037 N032 1.6n
C24 N034 N038 1n
C25 N039 N038 1n
C26 N036 N035 3n
C27 N040 N035 3n
R40 N042 N033 66.5k
R41 0 N042 33.2k
XU13 N042 N037 Vcc Vee N033 LM324  ; pins In+ In- V+ V- OUT
XU14 0 N039 Vcc Vee N034 LM324  ; pins In+ In- V+ V- OUT
XU15 0 N040 Vcc Vee N036 LM324  ; pins In+ In- V+ V- OUT
C28 Mid N036 10µ
R42 Mid 0 1k
R43 N043 Vi 78.7k
V5 N048 N062 SINE(0 0.5 3000) AC 1
R44 N044 N049 160k
R45 N050 N044 59k
R46 0 N050 7.87k
R47 N045 N051 243k
R48 N045 N046 107k
R49 N046 0 14.7k
R50 N047 N052 453k
C29 N044 N043 1n
C30 N049 N043 1n
C31 N045 N050 1n
C32 N051 N050 1n
C33 N047 N046 1n
C34 N052 N046 1n
R51 N043 0 26.7k
XU17 0 N049 Vcc Vee N044 LM324  ; pins In+ In- V+ V- OUT
XU18 0 N051 Vcc Vee N045 LM324  ; pins In+ In- V+ V- OUT
XU19 0 N052 Vcc Vee N047 LM324  ; pins In+ In- V+ V- OUT
C35 UpMid N047 1µ
R52 UpMid 0 1k
R53 N053 Vi 78.7k
V6 N062 N072 SINE(0 0.5 5000) AC 1
R54 N054 N058 160k
R55 N059 N054 66.5k
R56 0 N059 2.87k
R57 N055 N060 270k
R58 N055 N056 95.3k
R59 N056 0 4.02k
R60 N057 N061 383k
C36 N054 N053 1n
C37 N058 N053 1n
C38 N055 N059 1n
C39 N060 N059 1n
C40 N057 N056 1n
C41 N061 N056 1n
R61 N053 0 7.32k
XU21 0 N058 Vcc Vee N054 LM324  ; pins In+ In- V+ V- OUT
XU22 0 N060 Vcc Vee N055 LM324  ; pins In+ In- V+ V- OUT
XU23 0 N061 Vcc Vee N057 LM324  ; pins In+ In- V+ V- OUT
C42 Pres N057 1µ
R62 Pres 0 1k
R63 N063 Vi 11.5k
V7 N072 0 SINE(0 0.75 13000) AC 1
R64 N064 N068 22.6k
R65 N069 N064 8.06k
R66 0 N069 4.32k
R67 N065 N070 37.4k
R68 N065 N066 19.6k
R69 N066 0 10.7k
R70 N067 N071 90.9k
C43 N064 N063 1n
C44 N068 N063 1n
C45 N065 N069 820p
C46 N070 N069 820p
C47 N067 N066 1n
C48 N071 N066 1n
R71 N063 0 48.7k
XU25 0 N068 Vcc Vee N064 LM324  ; pins In+ In- V+ V- OUT
XU26 0 N070 Vcc Vee N065 LM324  ; pins In+ In- V+ V- OUT
XU27 0 N071 Vcc Vee N067 LM324  ; pins In+ In- V+ V- OUT
C49 Brill N067 1µ
R72 Brill 0 1k
V0 NC_01 0 SINE(0 0.8 7k) AC 1
R73 N001 Vi 73
.tran .01
;ac dec 100 20 20000
* [20Hz to 60Hz]
.include LM324.txt
* Sub-Bass
* Bass
* Lower-Midrange
* Midrange
* Upper-Midrange
* Presence
* Brilliance
.backanno
.end